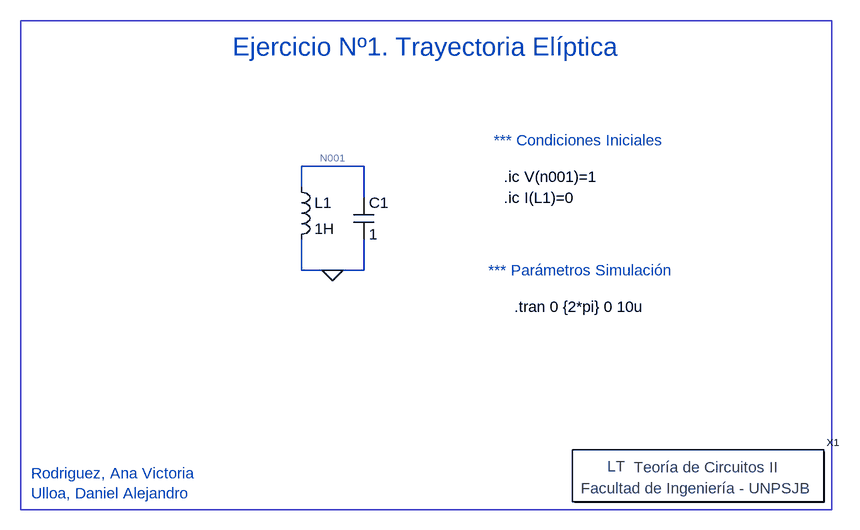
[diagram p0: schematic 01.asc]
01.asc, the LTspice schematic file:
Version 4
SHEET 1 1716 680
WIRE 992 -16 896 -16
WIRE 896 16 896 -16
WIRE 992 32 992 -16
WIRE 896 144 896 96
WIRE 944 144 896 144
WIRE 992 144 992 96
WIRE 992 144 944 144
FLAG 944 144 0
SYMBOL ind 880 0 R0
SYMATTR InstName L1
SYMATTR Value 1H
SYMBOL cap 976 32 R0
SYMATTR InstName C1
SYMATTR Value 1
SYMBOL Circuitos2\\Letreros\\Teoría\ de\ Circuitos\ II 1504 464 R0
SYMATTR InstName X1
TEXT 1224 200 Left 2 !.tran 0 {2*pi} 0 10u
TEXT 1208 0 Left 2 !.ic V(n001)=1
TEXT 1208 32 Left 2 !.ic I(L1)=0
TEXT 1088 -200 Center 4 ;Ejercicio Nº1. Trayectoria Elíptica
TEXT 480 456 Left 2 ;Rodriguez, Ana Victoria\nUlloa, Daniel Alejandro
TEXT 1192 -56 Left 2 ;*** Condiciones Iniciales
TEXT 1184 144 Left 2 ;*** Parámetros Simulación
RECTANGLE Normal 1712 512 464 -240

The netlist it stands for:
* 01.asc
L1 N001 0 1H
C1 N001 0 1
XX1 Teoría de Circuitos II
.tran 0 {2*pi} 0 10u
.ic V(n001)=1
.ic I(L1)=0
* Ejercicio Nº1. Trayectoria Elíptica
* Rodriguez, Ana Victoria
* Ulloa, Daniel Alejandro
* *** Condiciones Iniciales
* *** Parámetros Simulación
.backanno
.end